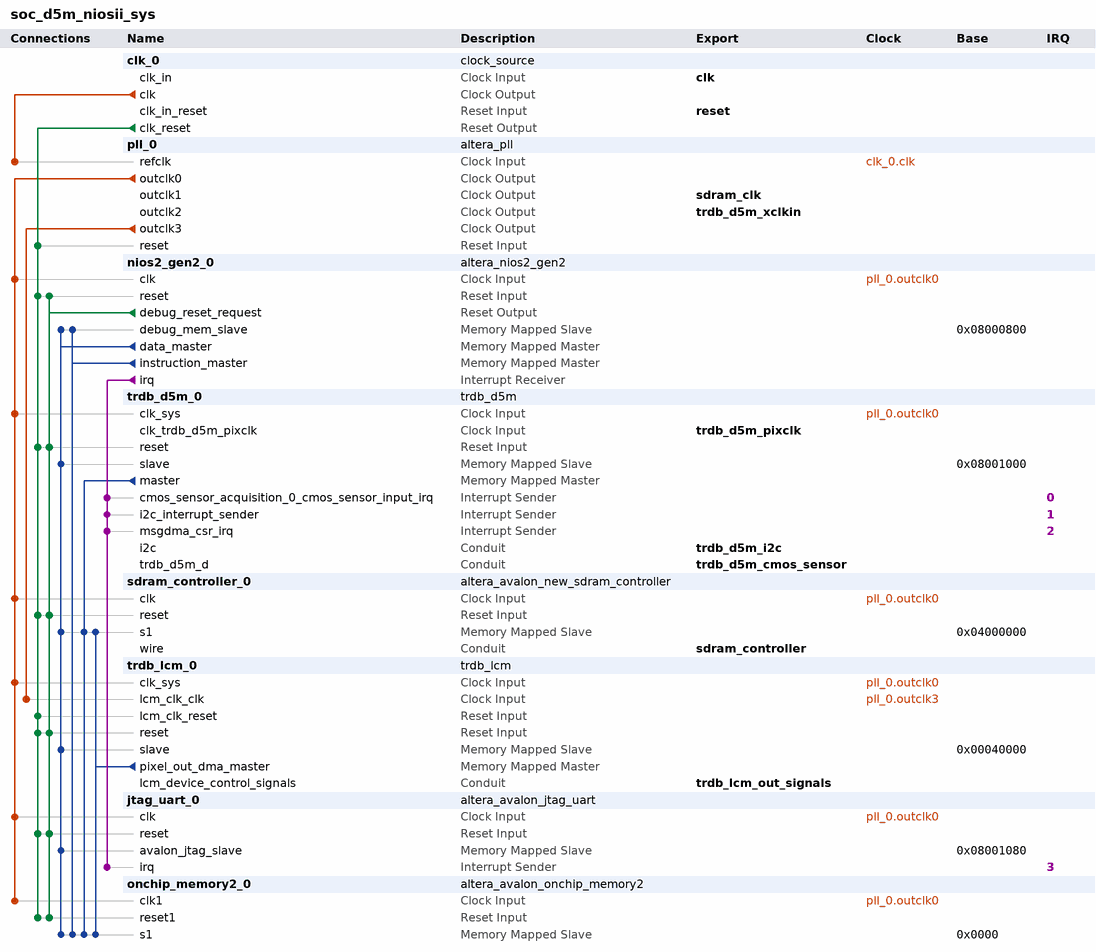
[diagram p0: system contents]
# Platform Designer (Qsys) system soc_d5m_niosii_sys, Cyclone V 5CSEMA5F31C6
# Parameters at their usual value, and those the tool derives, are not listed.
package require -exact qsys 20.1
create_system soc_d5m_niosii_sys
set_project_property DEVICE_FAMILY {Cyclone V}
set_project_property DEVICE 5CSEMA5F31C6

add_instance clk_0 clock_source 20.1
set_instance_parameter_value clk_0 clockFrequency 50000000

add_instance pll_0 altera_pll 20.1
set_instance_parameter_value pll_0 gui_device_speed_grade 2
set_instance_parameter_value pll_0 gui_number_of_clocks 4
set_instance_parameter_value pll_0 gui_operation_mode direct
set_instance_parameter_value pll_0 gui_output_clock_frequency0 50.0
set_instance_parameter_value pll_0 gui_output_clock_frequency1 50.0
set_instance_parameter_value pll_0 gui_output_clock_frequency2 75.0
set_instance_parameter_value pll_0 gui_output_clock_frequency3 18.42
set_instance_parameter_value pll_0 gui_phase_shift1 -3758
set_instance_parameter_value pll_0 gui_pll_mode {Integer-N PLL}
set_instance_parameter_value pll_0 gui_reference_clock_frequency 50.0
set_instance_parameter_value pll_0 gui_use_locked false

add_instance nios2_gen2_0 altera_nios2_gen2 20.1
set_instance_parameter_value nios2_gen2_0 dcache_size 0
set_instance_parameter_value nios2_gen2_0 exceptionSlave onchip_memory2_0.s1
set_instance_parameter_value nios2_gen2_0 icache_size 4096
set_instance_parameter_value nios2_gen2_0 impl Tiny
set_instance_parameter_value nios2_gen2_0 resetSlave onchip_memory2_0.s1

add_instance trdb_d5m_0 trdb_d5m 1.0

add_instance sdram_controller_0 altera_avalon_new_sdram_controller 20.1
set_instance_parameter_value sdram_controller_0 TAC 4.5
set_instance_parameter_value sdram_controller_0 TRCD 15.0
set_instance_parameter_value sdram_controller_0 TRP 15.0
set_instance_parameter_value sdram_controller_0 casLatency 3
set_instance_parameter_value sdram_controller_0 columnWidth 10
set_instance_parameter_value sdram_controller_0 dataWidth 16
set_instance_parameter_value sdram_controller_0 generateSimulationModel false
set_instance_parameter_value sdram_controller_0 model single_Micron_MT48LC4M32B2_7_chip
set_instance_parameter_value sdram_controller_0 numberOfBanks 4
set_instance_parameter_value sdram_controller_0 numberOfChipSelects 1
set_instance_parameter_value sdram_controller_0 powerUpDelay 100.0
set_instance_parameter_value sdram_controller_0 refreshPeriod 7.8215
set_instance_parameter_value sdram_controller_0 rowWidth 13

add_instance trdb_lcm_0 trdb_lcm 1.0

add_instance jtag_uart_0 altera_avalon_jtag_uart 20.1
set_instance_parameter_value jtag_uart_0 simInteractiveOptions NO_INTERACTIVE_WINDOWS

add_instance onchip_memory2_0 altera_avalon_onchip_memory2 20.1
set_instance_parameter_value onchip_memory2_0 dataWidth 32
set_instance_parameter_value onchip_memory2_0 dualPort false
set_instance_parameter_value onchip_memory2_0 initMemContent false
set_instance_parameter_value onchip_memory2_0 initializationFileName onchip_mem.hex
set_instance_parameter_value onchip_memory2_0 memorySize 200096

# connections
add_connection clk_0.clk pll_0.refclk clock
add_connection pll_0.outclk0 jtag_uart_0.clk clock
add_connection pll_0.outclk0 nios2_gen2_0.clk clock
add_connection pll_0.outclk0 onchip_memory2_0.clk1 clock
add_connection pll_0.outclk0 sdram_controller_0.clk clock
add_connection pll_0.outclk0 trdb_d5m_0.clk_sys clock
add_connection pll_0.outclk0 trdb_lcm_0.clk_sys clock
add_connection pll_0.outclk3 trdb_lcm_0.lcm_clk_clk clock
add_connection clk_0.clk_reset jtag_uart_0.reset reset
add_connection clk_0.clk_reset nios2_gen2_0.reset reset
add_connection clk_0.clk_reset onchip_memory2_0.reset1 reset
add_connection clk_0.clk_reset pll_0.reset reset
add_connection clk_0.clk_reset sdram_controller_0.reset reset
add_connection clk_0.clk_reset trdb_d5m_0.reset reset
add_connection clk_0.clk_reset trdb_lcm_0.lcm_clk_reset reset
add_connection clk_0.clk_reset trdb_lcm_0.reset reset
add_connection nios2_gen2_0.debug_reset_request jtag_uart_0.reset reset
add_connection nios2_gen2_0.debug_reset_request nios2_gen2_0.reset reset
add_connection nios2_gen2_0.debug_reset_request onchip_memory2_0.reset1 reset
add_connection nios2_gen2_0.debug_reset_request sdram_controller_0.reset reset
add_connection nios2_gen2_0.debug_reset_request trdb_d5m_0.reset reset
add_connection nios2_gen2_0.debug_reset_request trdb_lcm_0.reset reset
add_connection nios2_gen2_0.data_master jtag_uart_0.avalon_jtag_slave avalon
set_connection_parameter_value nios2_gen2_0.data_master/jtag_uart_0.avalon_jtag_slave baseAddress 0x08001080
add_connection nios2_gen2_0.data_master nios2_gen2_0.debug_mem_slave avalon
set_connection_parameter_value nios2_gen2_0.data_master/nios2_gen2_0.debug_mem_slave baseAddress 0x08000800
add_connection nios2_gen2_0.data_master onchip_memory2_0.s1 avalon
set_connection_parameter_value nios2_gen2_0.data_master/onchip_memory2_0.s1 baseAddress 0x0000
add_connection nios2_gen2_0.data_master sdram_controller_0.s1 avalon
set_connection_parameter_value nios2_gen2_0.data_master/sdram_controller_0.s1 baseAddress 0x04000000
add_connection nios2_gen2_0.data_master trdb_d5m_0.slave avalon
set_connection_parameter_value nios2_gen2_0.data_master/trdb_d5m_0.slave baseAddress 0x08001000
add_connection nios2_gen2_0.data_master trdb_lcm_0.slave avalon
set_connection_parameter_value nios2_gen2_0.data_master/trdb_lcm_0.slave baseAddress 0x00040000
add_connection nios2_gen2_0.instruction_master nios2_gen2_0.debug_mem_slave avalon
set_connection_parameter_value nios2_gen2_0.instruction_master/nios2_gen2_0.debug_mem_slave baseAddress 0x08000800
add_connection nios2_gen2_0.instruction_master onchip_memory2_0.s1 avalon
set_connection_parameter_value nios2_gen2_0.instruction_master/onchip_memory2_0.s1 baseAddress 0x0000
add_connection trdb_d5m_0.master onchip_memory2_0.s1 avalon
set_connection_parameter_value trdb_d5m_0.master/onchip_memory2_0.s1 baseAddress 0x0000
add_connection trdb_d5m_0.master sdram_controller_0.s1 avalon
set_connection_parameter_value trdb_d5m_0.master/sdram_controller_0.s1 baseAddress 0x04000000
add_connection trdb_lcm_0.pixel_out_dma_master onchip_memory2_0.s1 avalon
set_connection_parameter_value trdb_lcm_0.pixel_out_dma_master/onchip_memory2_0.s1 baseAddress 0x0000
add_connection trdb_lcm_0.pixel_out_dma_master sdram_controller_0.s1 avalon
set_connection_parameter_value trdb_lcm_0.pixel_out_dma_master/sdram_controller_0.s1 baseAddress 0x04000000
add_connection nios2_gen2_0.irq jtag_uart_0.irq interrupt
set_connection_parameter_value nios2_gen2_0.irq/jtag_uart_0.irq irqNumber 3
add_connection nios2_gen2_0.irq trdb_d5m_0.cmos_sensor_acquisition_0_cmos_sensor_input_irq interrupt
set_connection_parameter_value nios2_gen2_0.irq/trdb_d5m_0.cmos_sensor_acquisition_0_cmos_sensor_input_irq irqNumber 0
add_connection nios2_gen2_0.irq trdb_d5m_0.i2c_interrupt_sender interrupt
set_connection_parameter_value nios2_gen2_0.irq/trdb_d5m_0.i2c_interrupt_sender irqNumber 1
add_connection nios2_gen2_0.irq trdb_d5m_0.msgdma_csr_irq interrupt
set_connection_parameter_value nios2_gen2_0.irq/trdb_d5m_0.msgdma_csr_irq irqNumber 2

# exported interfaces
add_interface clk clock sink
set_interface_property clk EXPORT_OF clk_0.clk_in
add_interface reset reset sink
set_interface_property reset EXPORT_OF clk_0.clk_in_reset
add_interface sdram_clk clock source
set_interface_property sdram_clk EXPORT_OF pll_0.outclk1
add_interface sdram_controller conduit end
set_interface_property sdram_controller EXPORT_OF sdram_controller_0.wire
add_interface trdb_d5m_cmos_sensor conduit end
set_interface_property trdb_d5m_cmos_sensor EXPORT_OF trdb_d5m_0.trdb_d5m_d
add_interface trdb_d5m_i2c conduit end
set_interface_property trdb_d5m_i2c EXPORT_OF trdb_d5m_0.i2c
add_interface trdb_d5m_pixclk clock sink
set_interface_property trdb_d5m_pixclk EXPORT_OF trdb_d5m_0.clk_trdb_d5m_pixclk
add_interface trdb_d5m_xclkin clock source
set_interface_property trdb_d5m_xclkin EXPORT_OF pll_0.outclk2
add_interface trdb_lcm_out_signals conduit end
set_interface_property trdb_lcm_out_signals EXPORT_OF trdb_lcm_0.lcm_device_control_signals

set_interconnect_requirement {$system} qsys_mm.clockCrossingAdapter HANDSHAKE
set_interconnect_requirement {$system} qsys_mm.enableEccProtection FALSE
set_interconnect_requirement {$system} qsys_mm.insertDefaultSlave FALSE
set_interconnect_requirement {$system} qsys_mm.maxAdditionalLatency 1

save_system soc_d5m_niosii_sys.qsys
